# Altium schematic sheet 17_CAM_CONNECTOR.SchDoc
size 420 x 297 mm; SheetNumber: 17; SheetTotal: 27
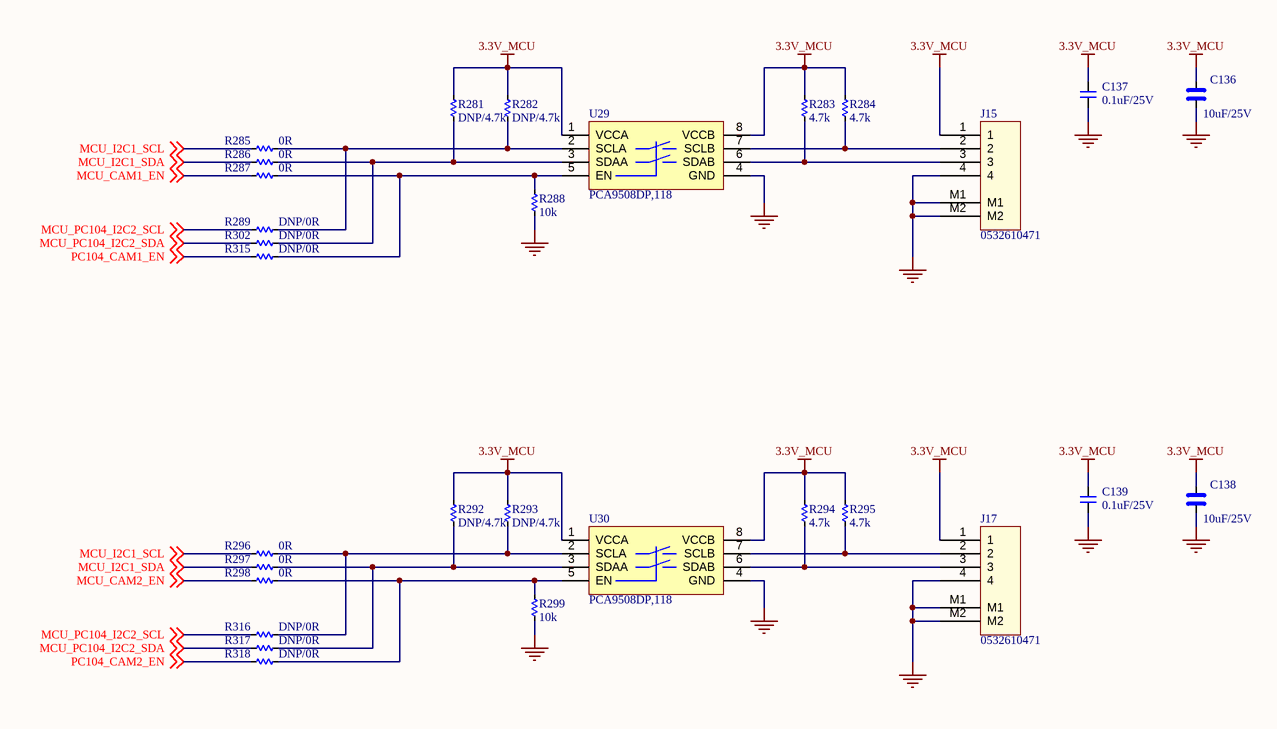
[diagram p0: 17_CAM_CONNECTOR.SchDoc]

## Parts
C136  10uF/25V  [CAP_C_2012X110]
C137  0.1uF/25V  [CAP_C_1005X60]
C138  10uF/25V  [CAP_C_2012X110]
C139  0.1uF/25V  [CAP_C_1005X60]
J15  0532610471  [MOLEX_0532610471]
J17  0532610471  [MOLEX_0532610471]
R281  DNP/4.7k  [RES_C_1005X40]
R282  DNP/4.7k  [RES_C_1005X40]
R283  4.7k  [RES_C_1005X40]
R284  4.7k  [RES_C_1005X40]
R285  0R  [RES_C_1005X40]
R286  0R  [RES_C_1005X40]
R287  0R  [RES_C_1005X40]
R288  10k  [RES_C_1005X40]
R289  DNP/0R  [RES_C_1005X40]
R292  DNP/4.7k  [RES_C_1005X40]
R293  DNP/4.7k  [RES_C_1005X40]
R294  4.7k  [RES_C_1005X40]
R295  4.7k  [RES_C_1005X40]
R296  0R  [RES_C_1005X40]
R297  0R  [RES_C_1005X40]
R298  0R  [RES_C_1005X40]
R299  10k  [RES_C_1005X40]
R302  DNP/0R  [RES_C_1005X40]
R315  DNP/0R  [RES_C_1005X40]
R316  DNP/0R  [RES_C_1005X40]
R317  DNP/0R  [RES_C_1005X40]
R318  DNP/0R  [RES_C_1005X40]
U29  PCA9508DP,118  [TSOP8]
U30  PCA9508DP,118  [TSOP8]

## Nets
3.3V_MCU: C136.1 C137.2 C138.1 C139.2 J15.1 J17.1 R281.1 R282.1 R283.1 R284.1 R292.1 R293.1 R294.1 R295.1 U29.1(VCCA) U29.8(VCCB) U30.1(VCCA) U30.8(VCCB)
GND: C136.2 C137.1 C138.2 C139.1 J15.4 J15.M1 J15.M2 J17.4 J17.M1 J17.M2 R288.2 R299.2 U29.4(GND) U30.4(GND)
MCU_CAM1_EN: R287.1 ; off-sheet MCU_CAM1_EN
MCU_CAM2_EN: R298.1 ; off-sheet MCU_CAM2_EN
MCU_I2C1_SCL: R285.1 R296.1 ; off-sheet MCU_I2C1_SCL
MCU_I2C1_SDA: R286.1 R297.1 ; off-sheet MCU_I2C1_SDA
MCU_PC104_I2C2_SCL: R289.1 R316.1 ; off-sheet MCU_PC104_I2C2_SCL
MCU_PC104_I2C2_SDA: R302.1 R317.1 ; off-sheet MCU_PC104_I2C2_SDA
PC104_CAM1_EN: R315.1 ; off-sheet PC104_CAM1_EN
PC104_CAM2_EN: R318.1 ; off-sheet PC104_CAM2_EN
NetJ15_2: J15.2 R284.2 U29.7(SCLB)
NetJ15_3: J15.3 R283.2 U29.6(SDAB)
NetJ17_2: J17.2 R295.2 U30.7(SCLB)
NetJ17_3: J17.3 R294.2 U30.6(SDAB)
NetR281_2: R281.2 R286.2 R302.2 U29.3(SDAA)
NetR282_2: R282.2 R285.2 R289.2 U29.2(SCLA)
NetR287_2: R287.2 R288.1 R315.2 U29.5(EN)
NetR292_2: R292.2 R297.2 R317.2 U30.3(SDAA)
NetR293_2: R293.2 R296.2 R316.2 U30.2(SCLA)
NetR298_2: R298.2 R299.1 R318.2 U30.5(EN)

## Notes on the sheet
- Project
- Sub-system:
- Design by:
- Sheet title:
- Sheet:
- of
- Checked by:
- Approved by:
- Doc no:
- Revision
- Size:
- Date:

## Library data of the parts
C136 C138 = _CAP_C_High_2: CAP High Value
C137 C139 = _CAP_C_2: CAP
J15 J17 = Header 4x1_2M_1
R281-R289 R292-R299 R302 R315-R318 = _RES_B_2: RES